# EAGLE design satcam_v4_pocket_revB (EAGLE 7.5.0)
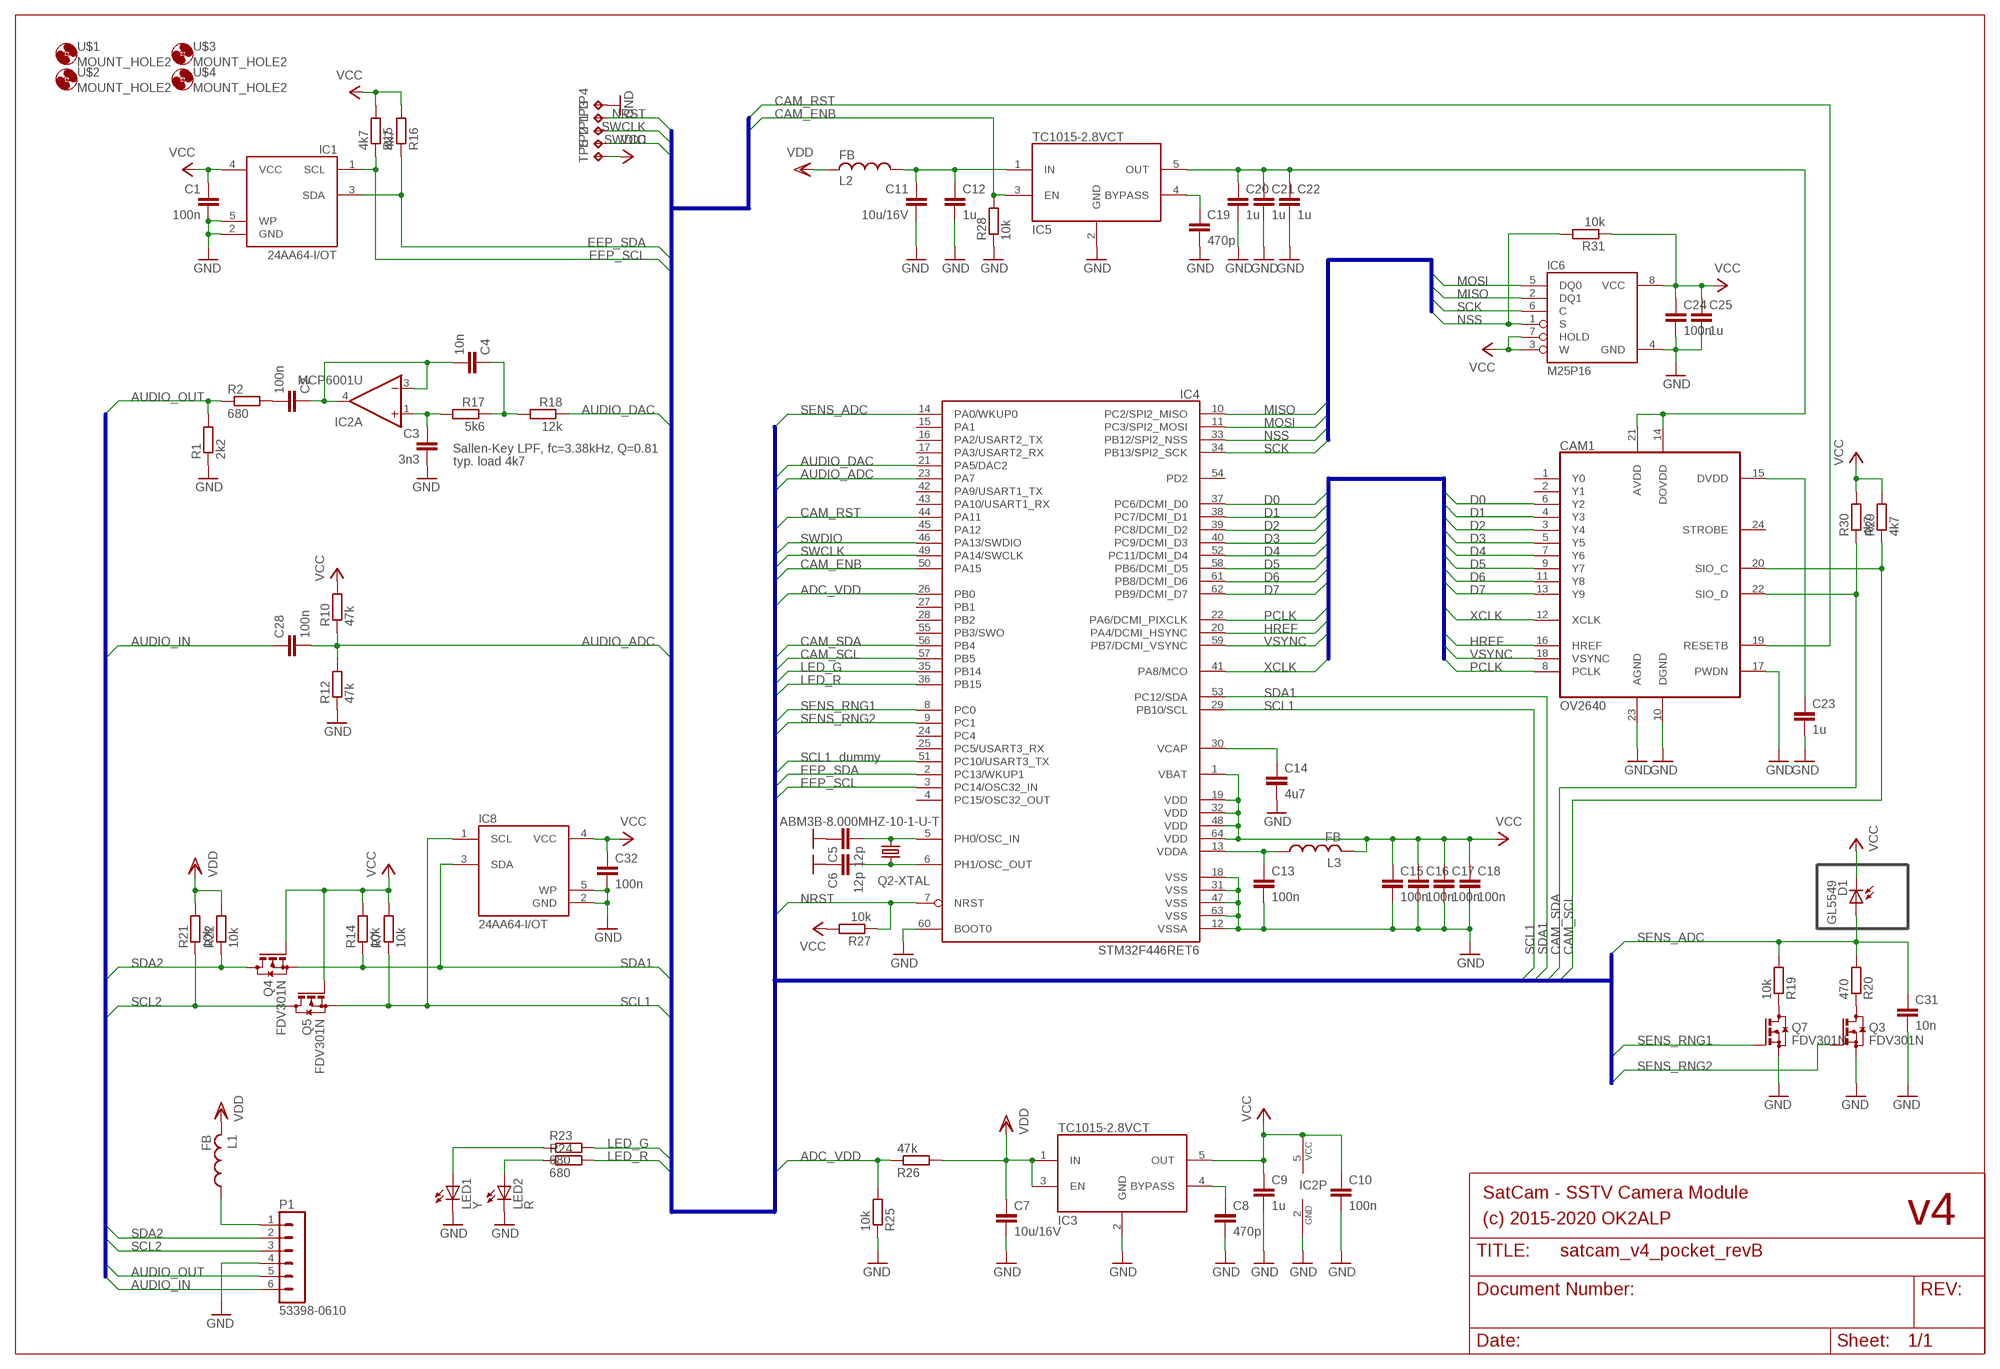
[diagram p0: schematic, sheet 1]

## Parts
C1  100n  C-EUC0603  [C0603]
C2  100n  C-EUC0603  [C0603]
C3  3n3  C-EUC0603  [C0603]
C4  10n  C-EUC0603  [C0603]
C5  12p  C-EUC0603  [C0603]
C6  12p  C-EUC0603  [C0603]
C7  10u/16V  C-EUC0805K  [C0805K]
C8  470p  C-EUC0603  [C0603]
C9  1u  C-EUC0603  [C0603]
C10  100n  C-EUC0603  [C0603]
C11  10u/16V  C-EUC0805K  [C0805K]
C12  1u  C-EUC0603  [C0603]
C13  100n  C-EUC0603  [C0603]
C14  4u7  C-EUC0603  [C0603]
C15  100n  C-EUC0603  [C0603]
C16  100n  C-EUC0603  [C0603]
C17  100n  C-EUC0603  [C0603]
C18  100n  C-EUC0603  [C0603]
C19  470p  C-EUC0603  [C0603]
C20  1u  C-EUC0603  [C0603]
C21  1u  C-EUC0402  [C0402]
C22  1u  C-EUC0402  [C0402]
C23  1u  C-EUC0402  [C0402]
C24  100n  C-EUC0603  [C0603]
C25  1u  C-EUC0603  [C0603]
C28  100n  C-EUC0603  [C0603]
C31  10n  C-EUC0603  [C0603]
C32  100n  C-EUC0603  [C0603]
CAM1  OV2640  [52745-2490]
D1  GL5549  SFH229  [LED3MM]
IC1  24AA64-I/OT  [SOT23-5]
IC2  MCP6001U  [SOT23-5]
IC3  TC1015-2.8VCT  TC1015  [SOT23-5]
IC4  STM32F446RET6  [TQFP64-10X10]
IC5  TC1015-2.8VCT  TC1015  [SOT23-5]
IC6  M25P16  [SO08]
IC8  24AA64-I/OT  [SOT23-5]
L1  FB  [R0603]
L2  FB  [R0603]
L3  FB  [R0603]
LED1  Y  LEDCHIP-LED0603  [CHIP-LED0603]
LED2  R  LEDCHIP-LED0603  [CHIP-LED0603]
P1  53398-0610  [53398-0610]
Q2  ABM3B-8.000MHZ-10-1-U-T  C3E_CRYSTAL-5032  [CER5032]
Q3  FDV301N  BSS123  [SOT23]
Q4  FDV301N  BSS123  [SOT23]
Q5  FDV301N  BSS123  [SOT23]
Q7  FDV301N  BSS123  [SOT23]
R1  2k2  R-EU_R0603  [R0603]
R2  680  R-EU_R0603  [R0603]
R7  10k  R-EU_R0603  [R0603]
R10  47k  R-EU_R0603  [R0603]
R12  47k  R-EU_R0603  [R0603]
R14  10k  R-EU_R0603  [R0603]
R15  4k7  R-EU_R0603  [R0603]
R16  4k7  R-EU_R0603  [R0603]
R17  5k6  R-EU_R0603  [R0603]
R18  12k  R-EU_R0603  [R0603]
R19  10k  R-EU_R0603  [R0603]
R20  470  R-EU_R0603  [R0603]
R21  10k  R-EU_R0603  [R0603]
R22  10k  R-EU_R0603  [R0603]
R23  680  R-EU_R0603  [R0603]
R24  680  R-EU_R0603  [R0603]
R25  10k  R-EU_R0603  [R0603]
R26  47k  R-EU_R0603  [R0603]
R27  10k  R-EU_R0603  [R0603]
R28  10k  R-EU_R0603  [R0603]
R29  4k7  R-EU_R0603  [R0603]
R30  4k7  R-EU_R0603  [R0603]
R31  10k  R-EU_R0603  [R0603]
TP1  TPB1,27  [B1,27]
TP2  TPB1,27  [B1,27]
TP3  TPB1,27  [B1,27]
TP4  TPB1,27  [B1,27]
TP5  TPB1,27  [B1,27]
U$1  MOUNT_HOLE2  [3,2]
U$2  MOUNT_HOLE2  [3,2]
U$3  MOUNT_HOLE2  [3,2]
U$4  MOUNT_HOLE2  [3,2]

## Nets
ADC_VDD: IC4.26(PB0) R25.2 R26.1
AUDIO_ADC: C28.2 IC4.23(PA7) R10.1 R12.2
AUDIO_DAC: IC4.21(PA5/DAC2) R18.1
AUDIO_IN: C28.1 P1.6
AUDIO_OUT: P1.5 R1.2 R2.1
CAM_ENB: IC4.50(PA15) IC5.3(EN) R28.2
CAM_RST: CAM1.19(RESETB) IC4.44(PA11)
CAM_SCL: CAM1.20(SIO_C) IC4.57(PB5) R29.1
CAM_SDA: CAM1.22(SIO_D) IC4.56(PB4) R30.1
D0: CAM1.6(Y2) IC4.37(PC6/DCMI_D0)
D1: CAM1.4(Y3) IC4.38(PC7/DCMI_D1)
D2: CAM1.3(Y4) IC4.39(PC8/DCMI_D2)
D3: CAM1.5(Y5) IC4.40(PC9/DCMI_D3)
D4: CAM1.7(Y6) IC4.52(PC11/DCMI_D4)
D5: CAM1.9(Y7) IC4.58(PB6/DCMI_D5)
D6: CAM1.11(Y8) IC4.61(PB8/DCMI_D6)
D7: CAM1.13(Y9) IC4.62(PB9/DCMI_D7)
EEP_SCL: IC1.1(SCL) IC4.3(PC14/OSC32_IN) R15.1
EEP_SDA: IC1.3(SDA) IC4.2(PC13/WKUP1) R16.1
GND: C1.2 C3.2 C5.1 C6.1 C7.2 C8.2 C9.2 C10.2 C11.2 C12.2 C13.2 C14.2 C15.2 C16.2 C17.2 C18.2 C19.2 C20.2 C21.2 C22.2 C23.2 C24.2 C25.2 C31.2 C32.2 CAM1.10(DGND) CAM1.17(PWDN) CAM1.23(AGND) IC1.2(GND) IC1.5(WP) IC2.2(P:GND) IC3.2(GND) IC4.12(VSSA) IC4.18(VSS) IC4.31(VSS) IC4.47(VSS) IC4.60(BOOT0) IC4.63(VSS) IC5.2(GND) IC6.4(GND) IC8.2(GND) IC8.5(WP) LED1.C LED2.C P1.4 Q2.2(-GND1:GND) Q2.4(-GND2:GND) Q3.2(S) Q7.2(S) R1.1 R12.1 R25.1 R28.1 TP4.TP
HREF: CAM1.16(HREF) IC4.20(PA4/DCMI_HSYNC)
LED_G: IC4.35(PB14) R23.2
LED_R: IC4.36(PB15) R24.2
MISO: IC4.10(PC2/SPI2_MISO) IC6.2(DQ1)
MOSI: IC4.11(PC3/SPI2_MOSI) IC6.5(DQ0)
N$1: C11.1 C12.1 IC5.1(IN) L2.1
N$2: C23.1 CAM1.15(DVDD)
N$4: C19.1 IC5.4(BYPASS)
N$7: L1.1 P1.1
N$9: C8.1 IC3.4(BYPASS)
N$10: LED2.A R24.1
N$11: LED1.A R23.1
N$12: C14.1 IC4.30(VCAP)
N$14: Q7.3(D) R19.1
N$15: Q3.3(D) R20.1
N$18: C13.1 IC4.13(VDDA) L3.1
N$26: C6.2 IC4.6(PH1/OSC_OUT) Q2.3
N$27: C5.2 IC4.5(PH0/OSC_IN) Q2.1
N$129: C2.1 C4.2 IC2.3(A:-IN) IC2.4(A:OUT)
N$130: C4.1 R17.1 R18.2
N$131: C3.1 IC2.1(A:+IN) R17.2
N$152: C2.2 R2.2
NRST: IC4.7(NRST) R27.1 TP3.TP
NSS: IC4.33(PB12/SPI2_NSS) IC6.1(S) R31.2
PCLK: CAM1.8(PCLK) IC4.22(PA6/DCMI_PIXCLK)
SCK: IC4.34(PB13/SPI2_SCK) IC6.6(C)
SCL1: IC4.29(PB10/SCL) IC4.51(PC10/USART3_TX) IC8.1(SCL) Q5.2(S) R7.1
SCL2: P1.3 Q5.3(D) R21.1
SDA1: IC4.53(PC12/SDA) IC8.3(SDA) Q4.2(S) R14.1
SDA2: P1.2 Q4.3(D) R22.1
SENS_ADC: C31.1 D1.A IC4.14(PA0/WKUP0) R19.2 R20.2
SENS_RNG1: IC4.8(PC0) Q7.1(G)
SENS_RNG2: IC4.9(PC1) Q3.1(G)
SWCLK: IC4.49(PA14/SWCLK) TP1.TP
SWDIO: IC4.46(PA13/SWDIO) TP2.TP
VCAM: C20.1 C21.1 C22.1 CAM1.14(DOVDD) CAM1.21(AVDD) IC5.5(OUT)
VCC: C1.1 C9.1 C10.1 C15.1 C16.1 C17.1 C18.1 C24.1 C25.1 C32.1 D1.K(C) IC1.4(VCC) IC2.5(P:VCC) IC3.5(OUT) IC4.1(VBAT) IC4.19(VDD) IC4.32(VDD) IC4.48(VDD) IC4.64(VDD) IC6.3(W) IC6.7(HOLD) IC6.8(VCC) IC8.4(VCC) L3.2 Q4.1(G) Q5.1(G) R7.2 R10.2 R14.2 R15.2 R16.2 R27.2 R29.2 R30.2 R31.1 TP5.TP
VDD: C7.1 IC3.1(IN) IC3.3(EN) L1.2 L2.2 R21.2 R22.2 R26.2
VSYNC: CAM1.18(VSYNC) IC4.59(PB7/DCMI_VSYNC)
XCLK: CAM1.12(XCLK) IC4.41(PA8/MCO)
Unconnected: CAM1.1(Y0) CAM1.2(Y1) CAM1.24(STROBE) IC4.4(PC15/OSC32_OUT) IC4.15(PA1) IC4.16(PA2/USART2_TX) IC4.17(PA3/USART2_RX) IC4.24(PC4) IC4.25(PC5/USART3_RX) IC4.27(PB1) IC4.28(PB2) IC4.42(PA9/USART1_TX) IC4.43(PA10/USART1_RX) IC4.45(PA12) IC4.54(PD2) IC4.55(PB3/SWO)

## Buses
D[0..7],PCLK,XCLK,HREF,VSYNC
ADC_VDD,AUDIO_DAC,AUDIO_ADC,CAM_RST,CAM_ENB,CAM_SDA,CAM_SCL,SWDIO,SWCLK,NRST,LED_R,LED_G,EEP_SDA,EEP_SCL,SENS_RNG1,SENS_RNG2,SENS_ADC,SDA1,SCL1
AUDIO_OUT,AUDIO_IN,PTT,SDA2,SCL2
MISO,MOSI,SCK,NSS

## Notes on the sheet
- Sallen-Key LPF, fc=3.38kHz, Q=0.81
- typ. load 4k7
- dummy
- SatCam - SSTV Camera Module
- (c) 2015-2020 OK2ALP | v4

## Library data of the parts
C1-C25 C28 C31 C32 = rcl:C-EU: CAPACITOR, European symbol
CAM1 = satcam:OV2640
D1 = satcam:SFH229
IC1 IC8 = satcam:24AA64
IC2 = satcam:MCP6001U
IC3 IC5 = satcam:TC1015
IC4 = satcam:STM32F446RET6
IC6 = satcam:M25P16
L1-L3 = satcam:FB
LED1 LED2 = led:LED: LED OSRAM: - CHIPLED LG R971, LG N971, LY N971, LG Q971, LY Q971, LO R971, LY R971 LH N974, LH R974 LS Q976, LO Q976, LY Q976 LO Q996 - Hyper CHIPLED LW Q18S LB Q993, LB Q99A, LB R99A - SideLED LS A670, LO A670, LY A670, LG A670, LP A670 LB A673, LV A673, LT A673, LW A673 LH A674 LY A675 LS A676, LA A676, LO A676, LY A676, LW A676 LS A679, LY A679, LG A679 - Hyper Micro SIDELED® LS Y876, LA Y876, LO Y876, LY Y876 LT Y87S - SmartLED LW L88C, LW L88S LB L89C, LB L89S, LG L890 LS L89K, LO L89K, LY L89K LS L896, LA L896, LO L896, LY L896 - TOPLED LS T670, LO T670, LY T670, LG T670, LP T670 LSG T670, LSP T670, LSY T670, LOP T670, LYG T670 LG T671, LOG T671, LSG T671 LB T673, LV T673, LT T673, LW T673 LH T674 LS T676, LA T676, LO T676, LY T676, LB T676, LH T676, LSB T676, LW T676 LB T67C, LV T67C, LT T67C, LS T67K, LO T67K, LY T67K, LW E67C LS E67B, LA E67B, LO E67B, LY E67B, LB E67C, LV E67C, LT E67C LW T67C LS T679, LY T679, LG T679 LS T770, LO T770, LY T770, LG T770, LP T770 LB T773, LV T773, LT T773, LW T773 LH T774 LS E675, LA E675, LY E675, LS T675 LS T776, LA T776, LO T776, LY T776, LB T776 LHGB T686 LT T68C, LB T68C - Hyper Mini TOPLED® LB M676 - Mini TOPLED Santana® LG M470 LS M47K, LO M47K, LY M47K Source: http://www.osram.convergy.de LUXEON: - LUMILED® LXK2-PW12-R00, LXK2-PW12-S00, LXK2-PW14-U00, LXK2-PW14-V00 LXK2-PM12-R00, LXK2-PM12-S00, LXK2-PM14-U00 LXK2-PE12-Q00, LXK2-PE12-R00, LXK2-PE12-S00, LXK2-PE14-T00, LXK2-PE14-U00 LXK2-PB12-K00, LXK2-PB12-L00, LXK2-PB12-M00, LXK2-PB14-N00, LXK2-PB14-P00, LXK2-PB14-Q00 LXK2-PR12-L00, LXK2-PR12-M00, LXK2-PR14-Q00, LXK2-PR14-R00 LXK2-PD12-Q00, LXK2-PD12-R00, LXK2-PD12-S00 LXK2-PH12-R00, LXK2-PH12-S00 LXK2-PL12-P00, LXK2-PL12-Q00, LXK2-PL12-R00 Source: www.luxeon.com KINGBRIGHT: KA-3528ASYC Source: www.kingbright.com
P1 = con-molex-picoblade:53398-0610: HEADER
Q2 = satcam:C3E_CRYSTAL
Q3-Q5 Q7 = transistor-small-signal:BSS123: N-CHANNEL MOS FET
R1 R2 R7 R10 R12 R14-R31 = rcl:R-EU_: RESISTOR, European symbol
TP1-TP5 = testpad:TP: Test pad
U$1-U$4 = satcam:MOUNT_HOLE2

## Board
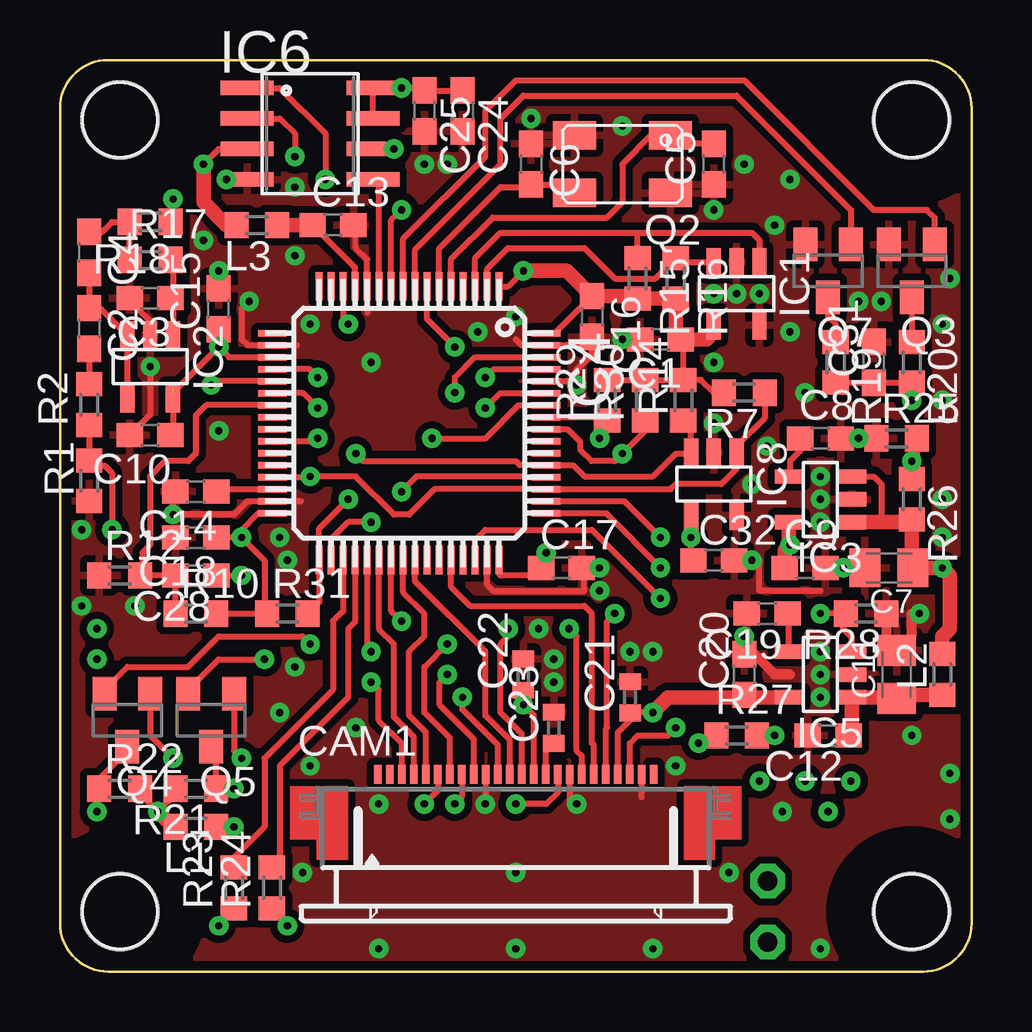
[diagram p1: board, top side]
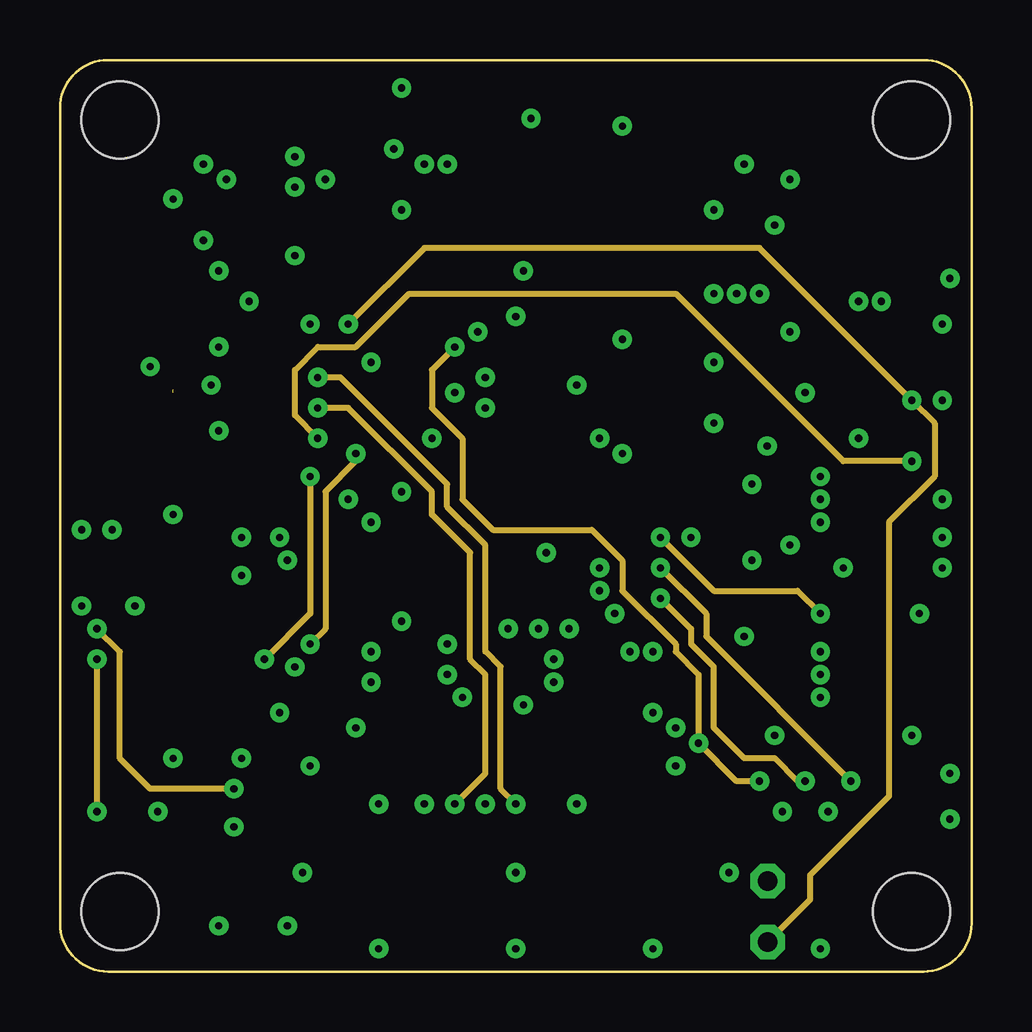
[diagram p2: board, inner layer Route2]
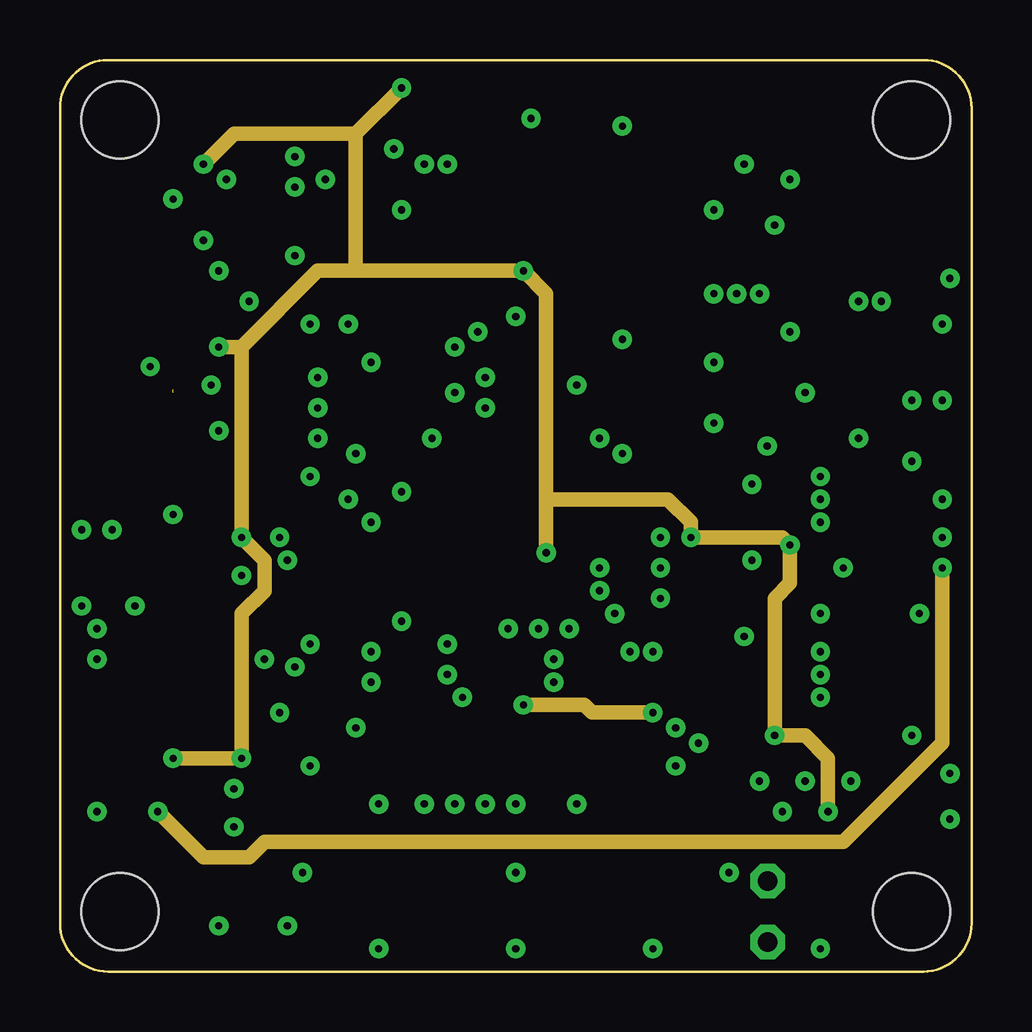
[diagram p3: board, inner layer Route3]
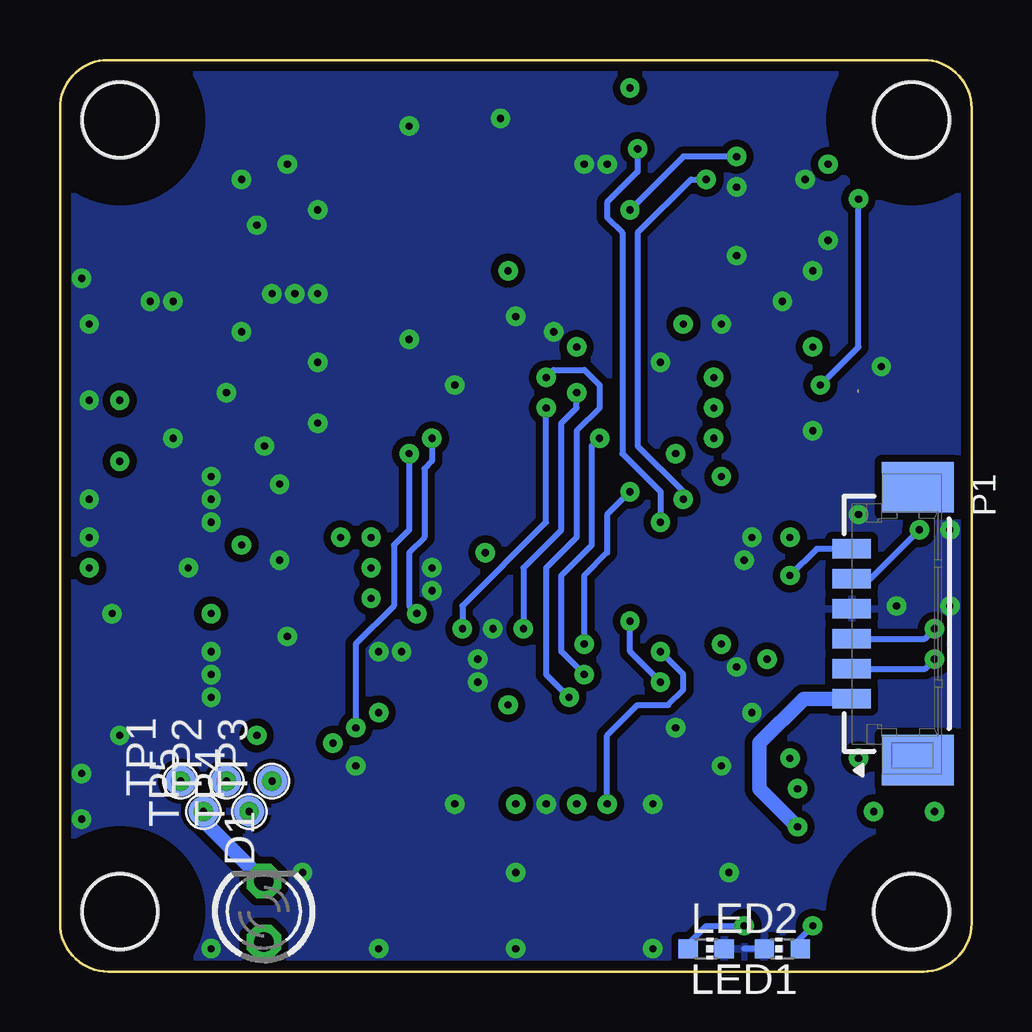
[diagram p4: board, bottom side, seen from below]

Size 38 x 38 mm. Coordinates in mm from the lower left corner, seen from the top.
Outline: 38,2 38,36 arc90 36,38 2,38 arc90 0,36 0,2 arc90 2,0 36,0 arc90 38,2
Copper layers (1*2+3*16): Top 0.035mm / dielectric 0.25mm / Route2 0.035mm / dielectric 1mm / Route3 0.035mm / dielectric 0.25mm / Bottom 0.035mm
Design rules "default *": minimum track width 10mil, minimum drill 0.3mm, track to track 8mil, track to pad 8mil, pad to pad 8mil, via to via 8mil, smd to smd 0mil, copper to edge 16mil, drill to drill 8mil, minimum pad ring 8mil, minimum via ring 10mil, stop-mask expansion 2mil, vias tented up to drill 0.4mm, thermal gap 12mil

### Footprints (pad centres in the part's own frame; a part is rotated, then mirrored left to right if it is on the bottom)
C0603 = smd 1.1 x 1: 1 -0.85,0; 2 0.85,0
C0805K = smd 1.3 x 1.6: 1 -1,0; 2 1,0
C0402 = smd 0.7 x 0.9: 1 -0.65,0; 2 0.65,0
52745-2490 = smd 0.3 x 0.8: 1 -5.75,2.5; 2 -5.25,2.5; 3 -4.75,2.5; 4 -4.25,2.5; 5 -3.75,2.5; 6 -3.25,2.5; 7 -2.75,2.5; 8 -2.25,2.5; 9 -1.75,2.5; 10 -1.25,2.5; 11 -0.75,2.5; 12 -0.25,2.5; 13 0.25,2.5; 14 0.75,2.5; 15 1.25,2.5; 16 1.75,2.5; 17 2.25,2.5; 18 2.75,2.5; 19 3.25,2.5; 20 3.75,2.5; 21 4.25,2.5; 22 4.75,2.5; 23 5.25,2.5; 24 5.75,2.5
LED3MM = drill 0.8 pad 1.422 octagon: A -1.27,0; K 1.27,0
SOT23-5 = smd 0.6 x 1.2: 1 -0.95,-1.306; 2 0,-1.306; 3 0.95,-1.306; 4 0.95,1.306; 5 -0.95,1.306
TQFP64-10X10 = smd 1.2 x 0.28: 1 -5.7,3.75; 2 -5.7,3.25; 3 -5.7,2.75; 4 -5.7,2.25; 5 -5.7,1.75; 6 -5.7,1.25; 7 -5.7,0.75; 8 -5.7,0.25; 9 -5.7,-0.25; 10 -5.7,-0.75; 11 -5.7,-1.25; 12 -5.7,-1.75; 13 -5.7,-2.25; 14 -5.7,-2.75; 15 -5.7,-3.25; 16 -5.7,-3.75; 33 5.7,-3.75; 34 5.7,-3.25; 35 5.7,-2.75; 36 5.7,-2.25; 37 5.7,-1.75; 38 5.7,-1.25; 39 5.7,-0.75; 40 5.7,-0.25; 41 5.7,0.25; 42 5.7,0.75; 43 5.7,1.25; 44 5.7,1.75; 45 5.7,2.25; 46 5.7,2.75; 47 5.7,3.25; 48 5.7,3.75 | smd 0.28 x 1.2: 17 -3.75,-5.7; 18 -3.25,-5.7; 19 -2.75,-5.7; 20 -2.25,-5.7; 21 -1.75,-5.7; 22 -1.25,-5.7; 23 -0.75,-5.7; 24 -0.25,-5.7; 25 0.25,-5.7; 26 0.75,-5.7; 27 1.25,-5.7; 28 1.75,-5.7; 29 2.25,-5.7; 30 2.75,-5.7; 31 3.25,-5.7; 32 3.75,-5.7; 49 3.75,5.7; 50 3.25,5.7; 51 2.75,5.7; 52 2.25,5.7; 53 1.75,5.7; 54 1.25,5.7; 55 0.75,5.7; 56 0.25,5.7; 57 -0.25,5.7; 58 -0.75,5.7; 59 -1.25,5.7; 60 -1.75,5.7; 61 -2.25,5.7; 62 -2.75,5.7; 63 -3.25,5.7; 64 -3.75,5.7
SO08 = smd 0.61 x 2.21: 1 -1.905,-2.616; 2 -0.635,-2.616; 3 0.635,-2.616; 4 1.905,-2.616; 5 1.905,2.616; 6 0.635,2.616; 7 -0.635,2.616; 8 -1.905,2.616
R0603 = smd 1 x 1.1: 1 -0.85,0; 2 0.85,0
CHIP-LED0603 = smd 0.8 x 0.8: A 0,-0.75; C 0,0.75
53398-0610 = smd 0.8 x 1.6: 1 3.125,0; 2 1.875,0; 3 0.625,0; 4 -0.625,0; 5 -1.875,0; 6 -3.125,0 | smd 2.1 x 3: M1 5.685,2.75; M2 -5.685,2.75
CER5032 = smd 1.8 x 1.2: 1 -2,-1.2; 2 2,-1.2; 3 2,1.2; 4 -2,1.2
SOT23 = smd 1 x 1.4: 1 -0.95,-1.1; 2 0.95,-1.1; 3 0,1.1
B1,27 = smd 1.27 x 1.27: TP 0,0
3,2 = hole 3.2: 0,0

### Placement (x,y rotation side)
C1  25.03,26.35 180 top
C2  1.22,26.8 270 top
C3  3.76,28.07 180 top
C4  1.22,29.98 270 top
C5  27.26,33.66 90 top
C6  19.64,33.66 270 top
C7  34.56,16.83 180 top
C8  31.7,22.23 0 top
C9  31.06,16.83 0 top
C10  3.76,22.36 180 top
C11  34.88,12.38 90 top
C12  32.02,9.84 180 top
C13  11.38,31.11 0 top
C14  5.66,20 180 top
C15  6.62,27.62 90 top
C16  22.18,27.3 270 top
C17  20.91,16.83 0 top
C18  5.66,18.1 180 top
C19  29.48,14.92 180 top
C20  28.52,12.38 90 top
C21  23.76,11.43 90 top
C22  19.32,12.38 90 top
C23  20.59,10.16 90 top
C24  16.78,35.88 270 top
C25  15.19,35.88 270 top
C28  5.66,16.51 180 top
C31  33.92,25.4 90 top
C32  27.26,17.14 0 top
CAM1  19,5.71 0 top
D1  29.5,2.5 90 bottom
IC1  28.21,28.26 180 top
IC2  3.76,25.22 180 top
IC3  31.7,19.68 90 top
IC4  14.55,22.86 270 top
IC5  31.7,12.38 90 top
IC6  10.43,34.92 270 top
IC8  27.26,20.32 180 top
L1  5.66,6.03 180 top
L2  36.78,12.38 90 top
L3  8.21,31.11 180 top
LED1  7.89,0.95 90 bottom
LED2  11.06,0.95 270 bottom
P1  5,14.5 270 bottom
Q2  23.45,33.66 180 top
Q3  35.51,29.21 180 top
Q4  2.81,10.48 180 top
Q5  6.3,10.48 180 top
Q7  32.02,29.21 180 top
R1  1.22,20.45 90 top
R2  1.22,23.63 90 top
R7  28.52,24.13 180 top
R10  5.66,14.92 0 top
R12  2.49,16.51 0 top
R14  25.98,23.81 90 top
R15  24.08,28.89 270 top
R16  25.67,28.89 270 top
R17  3.76,29.66 0 top
R18  3.76,31.25 180 top
R19  32.34,25.4 270 top
R20  35.51,25.4 270 top
R21  5.66,7.62 180 top
R22  2.49,7.62 0 top
R23  7.25,3.49 90 top
R24  8.84,3.49 90 top
R25  34.88,22.23 0 top
R26  35.51,19.68 270 top
R27  28.21,9.84 0 top
R28  33.61,14.92 180 top
R29  22.81,23.81 90 top
R30  24.4,23.81 90 top
R31  9.47,14.92 0 top
TP1  32.97,7.94 90 bottom
TP2  31.06,7.94 90 bottom
TP3  29.16,7.94 90 bottom
TP4  30.11,6.67 90 bottom
TP5  32.02,6.67 90 bottom
U$1  2.5,35.5 0 top
U$2  35.5,35.5 0 top
U$3  2.5,2.5 0 top
U$4  35.5,2.5 0 top

### Tracks (layer width: path | path; a pad name or v marks a point on that pad's centre or on a via)
ADC_VDD  (via drill 0.3)
  Top 0.254: R26.1 v35.51,21.27 35.73,21.49 R25.2 | IC4.26 10.63,22.11 v10.74,22.23
  Route2 0.254: v35.51,21.27 32.65,21.27 25.67,28.26 14.55,28.26 12.33,26.04 10.74,26.04 9.79,25.08 9.79,23.18 v10.74,22.23
AUDIO_ADC
  Top 0.254: IC4.23 6.1,23.61 5.66,23.18 5.66,21.59 5.35,21.27 4.39,21.27 3.76,20.64 3.76,17.78 3.44,17.46 3.44,16.61 R12.2 C28.2 R10.1
AUDIO_DAC  (via drill 0.3)
  Top 0.254: R18.1 4.61,32.1 v4.71,32.2 | IC4.21 6.46,24.61 v6.3,24.45
  Bottom 0.254: v6.3,24.45 4.71,26.04 v4.71,32.2
AUDIO_IN  (via drill 0.3)
  Top 0.254: C28.1 v7.57,16.51
  Bottom 0.254: P1.6 6.46,17.62 v7.57,16.51
AUDIO_OUT  (via drill 0.3)
  Top 0.254: R2.1 R1.2 1.22,21.09 1.86,21.09 2.17,20.77 v2.17,18.41
  Bottom 0.254: P1.5 4.21,16.38 v2.17,18.41
CAM_ENB  (via drill 0.3)
  Top 0.254: IC5.3 33.01,13.93 32.65,14.29 32.65,14.82 R28.2 v31.7,14.92 | IC4.50 23.52,19.61 v25.03,18.1
  Route2 0.254: v25.03,18.1 27.26,15.88 30.75,15.88 v31.7,14.92
CAM_RST
  Top 0.254: IC4.44 16.3,16.03 17.09,15.24 21.86,15.24 22.18,14.92 22.18,9.53 22.25,9.45 CAM1.19
CAM_SCL  (via drill 0.3)
  Top 0.254: CAM1.20 22.75,10.1 22.81,10.16 22.81,14.61 v23.13,14.92 | v22.49,22.23 22.81,22.54 R29.1 22.66,23.11 IC4.57
  Bottom 0.254: v22.49,22.23 22.49,21.27 22.81,20.95 22.81,18.1 23.45,17.46 23.45,15.24 v23.13,14.92
CAM_SDA  (via drill 0.3)
  Top 0.254: CAM1.22 23.75,9.51 24.08,9.84 25.35,9.84 v25.67,10.16 | R30.1 24.4,22.54 v23.45,21.59 23.13,21.27 22.17,21.27 21.7,21.75 21.7,22.07 21.16,22.61 IC4.56
  Bottom 0.254: v23.45,21.59 23.45,18.41 24.08,17.78 24.08,15.24 25.67,13.65 v25.67,10.16
D0  (via drill 0.3)
  Top 0.254: CAM1.6 15.75,7.54 v15.19,6.99 | IC4.37 12.8,13.5 v12.97,13.34
  Bottom 0.254: v15.19,6.99 15.19,9.84 13.92,11.11 12.65,11.11 12.02,11.75 12.02,12.38 v12.97,13.34
D1
  Top 0.254: IC4.38 13.3,14.27 13.92,13.65 13.92,10.6 14.75,9.77 CAM1.4
D2  (via drill 0.3)
  Top 0.254: IC4.39 13.8,15.04 v14.24,14.61 | CAM1.3 14.25,9.51 13.29,10.48 13.29,11.75 v12.97,12.06
  Bottom 0.254: v12.97,12.06 14.24,13.34 v14.24,14.61
D3
  Top 0.254: IC4.40 14.3,15.81 15.19,14.92 15.19,13.97 14.55,13.34 14.55,10.67 15.25,9.97 CAM1.5
D4  (via drill 0.3)
  Top 0.254: IC4.52 19.34,20.61 19.32,20.64 14.87,20.64 v14.24,20 | CAM1.7 16.25,9.73 15.19,10.79 15.19,12.7 v16.14,13.65
  Bottom 0.254: v16.14,13.65 16.14,16.51 15.19,17.46 15.19,19.05 v14.24,20
D5  (via drill 0.3)
  Top 0.254: IC4.58 19.11,23.61 17.73,22.23 v15.51,22.23 | CAM1.9 17.25,9.69 15.82,11.11 15.82,12.06 v16.14,12.38
  Bottom 0.254: v15.51,22.23 15.82,21.91 15.82,17.78 17.09,16.51 17.09,13.34 v16.14,12.38
D6  (via drill 0.3)
  Top 0.254: IC4.61 18.07,25.11 v17.73,24.77 | CAM1.11 18.25,9.45 16.78,10.92 v16.78,11.43
  Bottom 0.254: v16.78,11.43 17.73,12.38 17.73,16.83 16.46,18.1 16.46,22.54 15.51,23.5 15.51,24.45 16.14,25.08 17.41,25.08 v17.73,24.77
D7  (via drill 0.3)
  Top 0.254: IC4.62 17.3,25.61 16.46,24.77 v16.46,24.13 | CAM1.13 19.25,9.91 18.36,10.79 18.36,13.65 18.68,13.97 v18.68,14.29
  Bottom 0.254: v16.46,24.13 16.46,23.5 17.09,22.86 17.09,18.41 18.68,16.83 v18.68,14.29
EEP_SCL
  Top 0.254: IC4.3 17.3,29.74 18.36,30.8 24.08,30.8 | 29.16,29.53 IC1.1 29.16,30.48 28.84,30.8 24.08,30.8 | R15.1 24.08,30.8
EEP_SDA
  Top 0.254: IC4.2 17.8,29.29 18.68,30.16 21.86,30.16 23.13,28.89 24.82,28.89 R16.1 25.85,29.56 IC1.3
GND  (via drill 0.3)
  Top 0.254: C3.2 2.81,28.07 3.76,27.12 IC2.2 | 12.8,27.46 IC4.12 12.8,29.69 12.33,30.16 12.33,31.01 C13.2 | 10.04,19.61 IC4.31 7.81,19.61 7.25,19.05 v4.71,19.05 4.71,19.9 C14.2 | IC4.60 21.38,24.61 | 19,26.35 19.24,26.11 IC4.63 21.83,26.11 C16.2 | IC4.47 17.8,16.12 18.05,15.88 21.86,15.88 21.86,16.83 C17.2 | C15.2 6.62,28.57 | 7.57,27.62 7.57,26.35 7.81,26.11 IC4.18 9.87,26.11 | 17.75,7.26 CAM1.10 | 21.25,6.95 CAM1.17 | 24.25,7.26 CAM1.23 | 31.7,15.88 29.16,15.88 29.16,17.14 v28.84,17.14 | v3.76,25.22 3.76,23.21 C10.2 | v21.54,24.45 21.54,25.08 22.18,25.72 22.18,26.35
  Top 0.406: 30.43,12.38 29.8,12.38 28.84,13.34 28.52,13.34 | C11.2 35.51,14.02 35.51,14.92 | R28.1 34.45,13.76 34.88,13.34
  Bottom 0.254: LED1.C 9.47,0.95
  other vias: 22.49,16.83 31.7,19.68 31.7,20.64 31.7,18.73 6.62,29.21 23.45,35.24 30.43,33.02 5.98,30.48 28.21,28.26 12.97,25.4 33.29,22.23 19.64,35.56 9.16,18.1 31.7,12.38 23.76,13.34 24.71,13.34 19.95,14.29 20.59,13.02 21.54,6.99 17.73,6.99 22.49,15.88 28.52,13.97 9.79,32.7 13.29,6.99 35.51,9.84 27.26,31.75 19,4.13 31.7,13.34 31.7,11.43 30.11,6.67 35.83,14.92 27.26,22.86 27.26,28.26 29.16,28.26 30.43,26.67 27.26,25.4 32.65,16.83 15.19,33.66 16.14,33.66 6.94,33.02 19,27.3 17.41,26.67 34.24,27.94 33.29,27.94 28.84,20.32 10.11,4.13 23.45,26.35 0.9,18.41 7.89,27.94 10.43,26.99 6.62,22.54 3.12,15.24 0.9,15.24 12.33,10.16 9.79,12.7 9.16,10.79 24.71,0.95 36.78,18.1 29.48,21.91 31.06,24.13 36.78,23.81 37.1,28.89 29.8,31.11 28.52,33.66 9.79,29.84 31.7,0.95 37.1,6.35 20.59,12.06 36.78,19.68 36.78,26.99 9.47,17.14 10.43,8.57 37.1,8.26 25.67,8.57 27.89,4.13 13.29,0.95 19,0.95
  pour Top (isolate 0.305): -0.05,0 38.05,0 38.05,38.1 -0.05,38.1
  pour Bottom (isolate 0.305): -0.05,0 38.05,0 38.05,38.1 -0.05,38.1
HREF  (via drill 0.3)
  Top 0.254: IC4.20 10.4,25.11 v10.74,24.77 | CAM1.16 20.75,7.46 20.27,6.99 v19,6.99
  Route2 0.254: v10.74,24.77 11.7,24.77 16.14,20.32 16.14,19.37 17.73,17.78 17.73,13.34 18.36,12.7 18.36,7.62 v19,6.99
LED_G
  Top 0.254: IC4.35 11.8,15.03 11.38,14.61 11.38,11.75 8.52,8.89 8.52,6.03 7.25,4.76 R23.2
LED_R
  Top 0.254: IC4.36 12.3,14.58 12.02,14.29 12.02,11.43 9.16,8.57 9.16,4.66 R24.2
MISO  (via drill 0.3)
  Top 0.254: IC4.10 13.8,31.32 v14.24,31.75 | IC6.2 9.16,35.56 9.79,34.92 v9.79,33.97
  Bottom 0.254: v9.79,33.97 12.02,33.97 v14.24,31.75
MOSI
  Top 0.254: 13.92,33.02 IC6.5 13.3,32.76 IC4.11
N$1
  Top 0.61: L2.1 35.02,11.53 C11.1 34.83,11.43 IC5.1 33.01,9.98 C12.1
N$2
  Top 0.254: CAM1.15 20.25,9.17 C23.1
N$4
  Top 0.254: 30.43,14.82 C19.1 30.39,14.86 IC5.4
N$7  (via drill 0.3)
  Top 0.61: v7.25,6.03 L1.1
  Bottom 0.61: v7.25,6.03 8.84,7.62 8.84,9.53 6.99,11.38 P1.1
N$9
  Top 0.254: C8.1 30.85,21.69 30.43,21.27 30.43,20.67 IC3.4
N$10  (via drill 0.3)
  Top 0.254: v9.47,1.91 9.47,2.01 R24.1
  Bottom 0.254: LED2.A 11.7,0.95 11.7,1.27 11.06,1.91 v9.47,1.91
N$11  (via drill 0.3)
  Top 0.254: v6.62,1.91 6.62,2.01 R23.1
  Bottom 0.254: LED1.A 7.25,0.95 7.25,1.27 v6.62,1.91
N$12
  Top 0.254: C14.1 6.62,20 6.72,20.11 IC4.30
N$14
  Top 0.254: Q7.3 32.02,27.3 32.34,26.99 R19.1
N$15
  Top 0.254: Q3.3 R20.1
N$18
  Top 0.254: IC4.13 12.3,29.34 C13.1
  Top 0.61: L3.1 C13.1
N$26
  Top 0.254: 19.32,32.49 C6.2 | C6.2 21.09,32.8 Q2.3 | IC4.6 15.8,30.14 18.36,32.7 19.53,32.7 C6.2
N$27
  Top 0.254: IC4.5 16.3,29.69 18.05,31.43 22.81,31.43 23.45,32.07 23.45,33.66 24.64,34.85 Q2.1 25.8,34.51 C5.2
N$129
  Top 0.254: C4.2 C2.1 1.68,27.66 IC2.3 2.81,26.17 | IC2.4 2.81,26.17 | 2.81,26.17 2.81,26.39
N$130
  Top 0.254: R17.1 R18.2 2.17,31.25 1.75,30.83 C4.1
N$131
  Top 0.254: IC2.1 4.71,28.07 | R17.2 4.71,29.66 4.71,28.07 | 4.71,28.07 C3.1
N$152
  Top 0.254: C2.2 R2.2
NRST  (via drill 0.3)
  Top 0.254: IC4.7 15.3,27.19 v16.46,26.04 | R27.1 27.04,9.53 v26.62,9.53
  Route2 0.254: v26.62,9.53 26.62,12.38 25.67,13.34 25.67,13.65 23.45,15.88 23.45,17.14 22.18,18.41 18.05,18.41 16.78,19.68 16.78,22.23 15.51,23.5 15.51,25.08 v16.46,26.04 | v26.62,9.53 26.94,9.21 | TP3.TP 28.21,7.94 v26.62,9.53
  other vias: 29.16,7.94
NSS  (via drill 0.3)
  Top 0.254: IC6.1 9.16,36.83 11.06,34.92 v11.06,33.02 | v12.02,19.68 10.8,18.48 IC4.33 10.8,15.4 R31.2
  Bottom 0.254: v11.06,33.02 11.7,33.02 13.92,30.8 13.92,21.91 12.02,20 v12.02,19.68
PCLK  (via drill 0.3)
  Top 0.254: IC4.22 10.13,24.11 v10.74,23.5 | CAM1.8 16.75,7.28 v16.46,6.99
  Route2 0.254: v10.74,23.5 12.02,23.5 15.51,20 15.51,19.05 17.09,17.46 17.09,13.02 17.73,12.38 17.73,8.26 v16.46,6.99
SCK  (via drill 0.3)
  Top 0.254: v13.92,34.29 IC6.6 | IC4.34 11.3,18.02 12.02,18.73 v12.97,18.73
  Bottom 0.254: v13.92,34.29 13.92,33.34 15.19,32.07 15.19,31.43 14.55,30.8 14.55,21.59 12.97,20 v12.97,18.73
SCL1  (via drill 0.3)
  Top 0.254: R7.1 29.38,23.07 28.2,21.91 IC8.1 28.2,20.95 27.57,20.32 25.67,20.32 25.46,20.11 IC4.51 15.62,20.11 14.55,19.05 13.92,19.05 12.33,20.64 v10.43,20.64 10.4,20.61 IC4.29 | Q5.2 5.35,11.75 6.62,13.02 v8.52,13.02
  Route2 0.254: v10.43,20.64 10.43,14.92 v8.52,13.02
SCL2  (via drill 0.3)
  Top 0.254: v7.25,7.62 R21.1 6.52,9.16 Q5.3
  Route2 0.254: v7.25,7.62 3.76,7.62 2.49,8.89 2.49,13.34 v1.54,14.29
  Bottom 0.254: P1.3 1.95,13.88 v1.54,14.29
SDA1  (via drill 0.3)
  Top 0.254: v12.33,21.59 12.65,21.27 19,21.27 19.16,21.11 IC4.53 21.38,21.11 21.86,20.64 24.71,20.64 25.67,21.59 26.27,21.59 IC8.3 26.3,22.64 R14.1 | Q4.2 1.86,11.75 2.81,12.7 5.35,12.7 6.62,13.97 10.11,13.97 v10.43,13.65
  Route2 0.254: v12.33,21.59 12.33,21.27 11.06,20 11.06,14.29 v10.43,13.65
SDA2  (via drill 0.3)
  Top 0.254: Q4.3 2.49,9.06 2.49,8.89 1.64,8.04 R22.1 1.54,7.52 v1.54,6.67
  Route2 0.254: v1.54,13.02 v1.54,6.67
  Bottom 0.254: P1.2 1.93,12.62 v1.54,13.02
SENS_ADC  (via drill 0.3)
  Top 0.254: v35.51,23.81 R20.2 C31.1 R19.2 | IC4.14 11.8,27.2 v12.02,26.99
  Route2 0.254: v12.02,26.99 15.19,30.16 29.16,30.16 v35.51,23.81 36.46,22.86 36.46,20.64 34.56,18.73 34.56,7.3 31.27,4.01 31.27,3 D1.A
SENS_RNG1
  Top 0.254: IC4.8 14.8,30.09 18.36,33.66 18.36,35.56 19.32,36.51 28.21,36.51 32.97,31.75 Q7.1
SENS_RNG2
  Top 0.254: IC4.9 14.3,30.55 17.73,33.97 17.73,35.88 19,37.15 28.52,37.15 33.92,31.75 36.14,31.75 36.46,31.43 Q3.1
SWCLK  (via drill 0.3)
  Top 0.254: IC4.49 22.75,19.11 v25.03,16.83
  Route2 0.254: v25.03,16.83 26.94,14.92 26.94,13.97 TP1.TP
  other vias: 32.97,7.94
SWDIO  (via drill 0.3)
  Top 0.254: IC4.46 17.3,17.99 17.73,18.41 22.18,18.41 v25.03,15.56
  Route2 0.254: v25.03,15.56 26.3,14.29 26.3,13.65 27.26,12.7 27.26,10.16 28.52,8.89 29.8,8.89 30.75,7.94 TP2.TP
  other vias: 31.06,7.94
VCAM  (via drill 0.3)
  Top 0.254: CAM1.21 23.25,9.96 23.76,10.48 C21.1 23.78,10.79 v24.71,10.79 | CAM1.14 19.75,10.68 v19.32,11.11 C22.1
  Top 0.61: IC5.5 28.62,11.43 C20.1 28.42,11.43 25.35,11.43 v24.71,10.79
  Route3 0.61: v19.32,11.11 21.86,11.11 22.18,10.79 v24.71,10.79
VCC  (via drill 0.3)  (1 unrouted)
  Top 0.254: 4.71,24.27 4.71,24.26 | v7.57,18.1 C18.1 | IC4.32 8.27,19.11 7.57,18.41 v7.57,18.1 | 19.7,26.61 IC4.64 20.63,26.61 C16.1 | IC4.48 18.3,16.57 18.36,16.51 19.95,16.51 20.05,16.61 C17.1 20.27,17.04 v20.27,17.46 | IC4.19 7.04,25.61 v6.62,26.04 | v6.62,26.04 C15.1 | 27.26,26.98 IC1.4 | IC4.1 18.67,28.56 v19.32,29.21 | IC6.7 IC6.8 v14.24,36.83 15.09,36.83 C25.1 C24.1 | C10.1 4.71,22.46 IC2.5 4.71,24.13 v6.62,26.04 | v5.98,33.66 6.62,34.29 IC6.3 | C32.1 26.3,17.25 v26.3,18.09 v26.3,18.1 IC8.4 | R7.2 27.26,24.13 26.72,24.66 26.09,24.66 | 26.09,24.66 R14.2 R30.2 R29.2 | 26.09,24.66 25.98,24.77 25.98,26.25 | Q5.1 7.25,9.21 v7.57,8.89 | Q4.1 3.76,9.85 v4.71,8.89 | R27.2 v29.8,9.84 | v7.57,18.1 8.52,17.14 8.52,15.03 R31.1 R10.2
  Top 0.61: C9.1 30.11,16.83 30.12,16.83 | 27.26,26.99 27.26,26.98 | 30.39,17.01 C9.1 | IC3.5 30.39,17.82 v30.43,17.78 30.21,17.57 C9.1 | R15.2 R16.2 25.67,26.57 C1.1 | L3.2 6.94,31.11 5.98,32.07 v5.98,33.66 | 23.98,27.94 R15.2 | R15.2 23.97,28.16 C16.1 21.12,29.21 v19.32,29.21 | C1.1 26.94,26.35 27.26,26.67 IC1.4 | 25.98,26.25 C1.1
  Route3 0.61: 7.57,26.04 10.74,29.21 12.33,29.21 | 12.33,29.21 v19.32,29.21 20.27,28.26 20.27,19.68 | v14.24,36.83 12.33,34.92 | 12.33,34.92 12.33,29.21 | 7.57,26.04 v7.57,18.1 8.52,17.14 8.52,15.88 7.57,14.92 v7.57,8.89 v4.71,8.89 | 7.57,26.04 v6.62,26.04 | 20.27,19.68 v20.27,17.46 | v5.98,33.66 7.25,34.92 12.33,34.92 | 20.27,19.68 25.35,19.68 26.3,18.73 v26.3,18.1 30.11,18.1 v30.43,17.78 30.43,16.19 29.8,15.56 v29.8,9.84 31.06,9.84 32.02,8.89 TP5.TP
  Bottom 0.61: TP5.TP 32.02,6.29 D1.K
  other vias: 32.02,6.67
VDD  (via drill 0.3)
  Top 0.254: IC3.3 33.92,20.64 34.24,20.32 34.24,18.73 | R22.2 3.34,7.41 v4.08,6.67 4.81,7.41 R21.2
  Top 0.61: L2.2 36.78,13.97 37.1,14.29 37.1,16.51 v36.78,16.83 C7.1 35.51,16.88 R26.2 35.41,18.73 34.24,18.73 IC3.1 | L1.2 4.71,6.03 v4.08,6.67
  Route3 0.61: v36.78,16.83 36.78,9.53 32.65,5.4 8.52,5.4 7.89,4.76 5.98,4.76 v4.08,6.67
VSYNC  (via drill 0.3)
  Top 0.254: IC4.59 18.34,24.11 v17.73,23.5 | CAM1.18 21.75,9 21.54,9.21 21.54,13.97 v21.22,14.29
  Bottom 0.254: v17.73,23.5 17.73,18.73 21.22,15.24 v21.22,14.29
XCLK
  Top 0.254: IC4.41 14.8,16.26 17.73,13.34 17.73,10.67 18.75,9.65 CAM1.12

### Text on the board
silk: SSTV CAMERA | OK2ALP v4B/2020 | IN | AUDIO | GND | SCL | SDA | VDD | RS | DT | CK | 0V | + | BSY | CAM | LIGHT